# EAGLE design MOTOR DRIVER L298N (EAGLE 9.6.2)
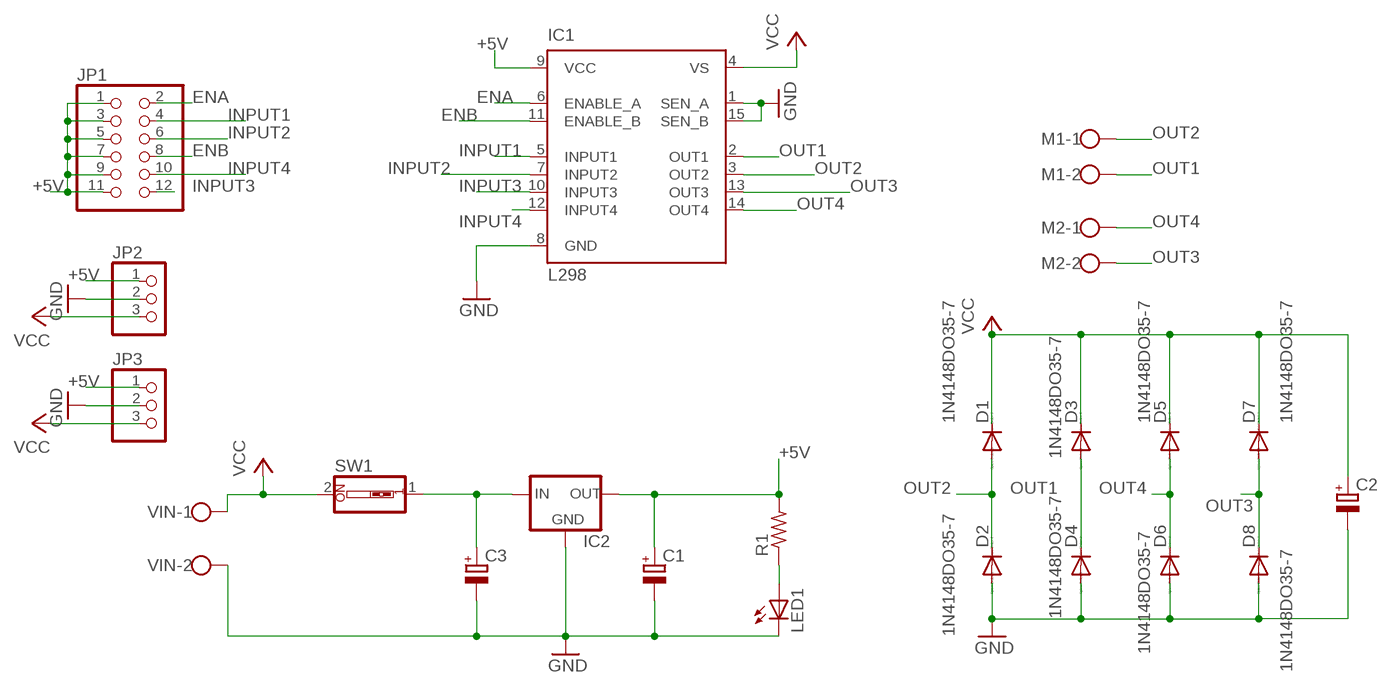
[diagram p0: schematic, sheet 1]

## Parts
C1  CPOL-EUE5-6  [E5-6]
C2  CPOL-EUE5-6  [E5-6]
C3  CPOL-EUE5-6  [E5-6]
D1  1N4148DO35-7  [DO35-7]
D2  1N4148DO35-7  [DO35-7]
D3  1N4148DO35-7  [DO35-7]
D4  1N4148DO35-7  [DO35-7]
D5  1N4148DO35-7  [DO35-7]
D6  1N4148DO35-7  [DO35-7]
D7  1N4148DO35-7  [DO35-7]
D8  1N4148DO35-7  [DO35-7]
IC1  L298  [MULTIWATT-15]
IC2  78MXXS  [78MXXS]
JP1  PINHD-2X6  [2X06]
JP2  PINHD-1X3  [1X03]
JP3  PINHD-1X3  [1X03]
LED1  LED5MM  [LED5MM]
M1  W237-102  [W237-102]
M2  W237-102  [W237-102]
R1  R-US_0204/7  [0204/7]
SW1  SW_DIP-1  [EDG-01]
VIN  W237-102  [W237-102]

## Nets
+5V: C1.+ IC1.9(VCC) IC2.OUT JP1.1 JP1.3 JP1.5 JP1.7 JP1.9 JP1.11 JP2.1 JP3.1 R1.2
ENA: IC1.6(ENABLE_A) JP1.2
ENB: IC1.11(ENABLE_B) JP1.8
GND: C1.- C2.- C3.- D2.A D4.A D6.A D8.A IC1.1(SEN_A) IC1.8(GND) IC1.15(SEN_B) IC2.GND JP2.2 JP3.2 LED1.K(C) VIN.2
INPUT1: IC1.5(INPUT1) JP1.4
INPUT2: IC1.7(INPUT2) JP1.6
INPUT3: IC1.10(INPUT3) JP1.12
INPUT4: IC1.12(INPUT4) JP1.10
N$2: LED1.A R1.1
N$3: C3.+ IC2.IN SW1.1
OUT1: D3.A D4.C IC1.2(OUT1) M1.2
OUT2: D1.A D2.C IC1.3(OUT2) M1.1
OUT3: D7.A D8.C IC1.13(OUT3) M2.2
OUT4: D5.A D6.C IC1.14(OUT4) M2.1
VCC: C2.+ D1.C D3.C D5.C D7.C IC1.4(VS) JP2.3 JP3.3 SW1.2 VIN.1

## Library data of the parts
C1-C3 = rcl:CPOL-EU: POLARIZED CAPACITOR, European symbol; SPICEPREFIX: C
D1-D8 = diode:1N4148: DIODE high speed (Philips)
IC1 = st-microelectronics:L298: DUAL FULL-BRIDGE DRIVER; MPN: L298N; OC_FARNELL: 1589425; OC_NEWARK: 32M1527
IC2 = v-reg:78MXXS: VOLTAGE REGULATOR
JP1 = pinhead:PINHD-2X6: PIN HEADER
JP2 JP3 = pinhead:PINHD-1X3: PIN HEADER
LED1 = led:LED: LED OSRAM: - CHIPLED LG R971, LG N971, LY N971, LG Q971, LY Q971, LO R971, LY R971 LH N974, LH R974 LS Q976, LO Q976, LY Q976 LO Q996 - Hyper CHIPLED LW Q18S LB Q993, LB Q99A, LB R99A - SideLED LS A670, LO A670, LY A670, LG A670, LP A670 LB A673, LV A673, LT A673, LW A673 LH A674 LY A675 LS A676, LA A676, LO A676, LY A676, LW A676 LS A679, LY A679, LG A679 - Hyper Micro SIDELED® LS Y876, LA Y876, LO Y876, LY Y876 LT Y87S - SmartLED LW L88C, LW L88S LB L89C, LB L89S, LG L890 LS L89K, LO L89K, LY L89K LS L896, LA L896, LO L896, LY L896 - TOPLED LS T670, LO T670, LY T670, LG T670, LP T670 LSG T670, LSP T670, LSY T670, LOP T670, LYG T670 LG T671, LOG T671, LSG T671 LB T673, LV T673, LT T673, LW T673 LH T674 LS T676, LA T676, LO T676, LY T676, LB T676, LH T676, LSB T676, LW T676 LB T67C, LV T67C, LT T67C, LS T67K, LO T67K, LY T67K, LW E67C LS E67B, LA E67B, LO E67B, LY E67B, LB E67C, LV E67C, LT E67C LW T67C LS T679, LY T679, LG T679 LS T770, LO T770, LY T770, LG T770, LP T770 LB T773, LV T773, LT T773, LW T773 LH T774 LS E675, LA E675, LY E675, LS T675 LS T776, LA T776, LO T776, LY T776, LB T776 LHGB T686 LT T68C, LB T68C - Hyper Mini TOPLED® LB M676 - Mini TOPLED Santana® LG M470 LS M47K, LO M47K, LY M47K Source: http://www.osram.convergy.de LUXEON: - LUMILED® LXK2-PW12-R00, LXK2-PW12-S00, LXK2-PW14-U00, LXK2-PW14-V00 LXK2-PM12-R00, LXK2-PM12-S00, LXK2-PM14-U00 LXK2-PE12-Q00, LXK2-PE12-R00, LXK2-PE12-S00, LXK2-PE14-T00, LXK2-PE14-U00 LXK2-PB12-K00, LXK2-PB12-L00, LXK2-PB12-M00, LXK2-PB14-N00, LXK2-PB14-P00, LXK2-PB14-Q00 LXK2-PR12-L00, LXK2-PR12-M00, LXK2-PR14-Q00, LXK2-PR14-R00 LXK2-PD12-Q00, LXK2-PD12-R00, LXK2-PD12-S00 LXK2-PH12-R00, LXK2-PH12-S00 LXK2-PL12-P00, LXK2-PL12-Q00, LXK2-PL12-R00 Source: www.luxeon.com KINGBRIGHT: KA-3528ASYC Source: www.kingbright.com
M1 M2 VIN = con-wago-500:W237-102: WAGO SCREW CLAMP; MPN: 237-102; OC_FARNELL: unknown; OC_NEWARK: 70K9898
R1 = rcl:R-US_: RESISTOR, American symbol; SPICEPREFIX: R
SW1 = special:SW_DIP-1: DIP SWITCH

## Board
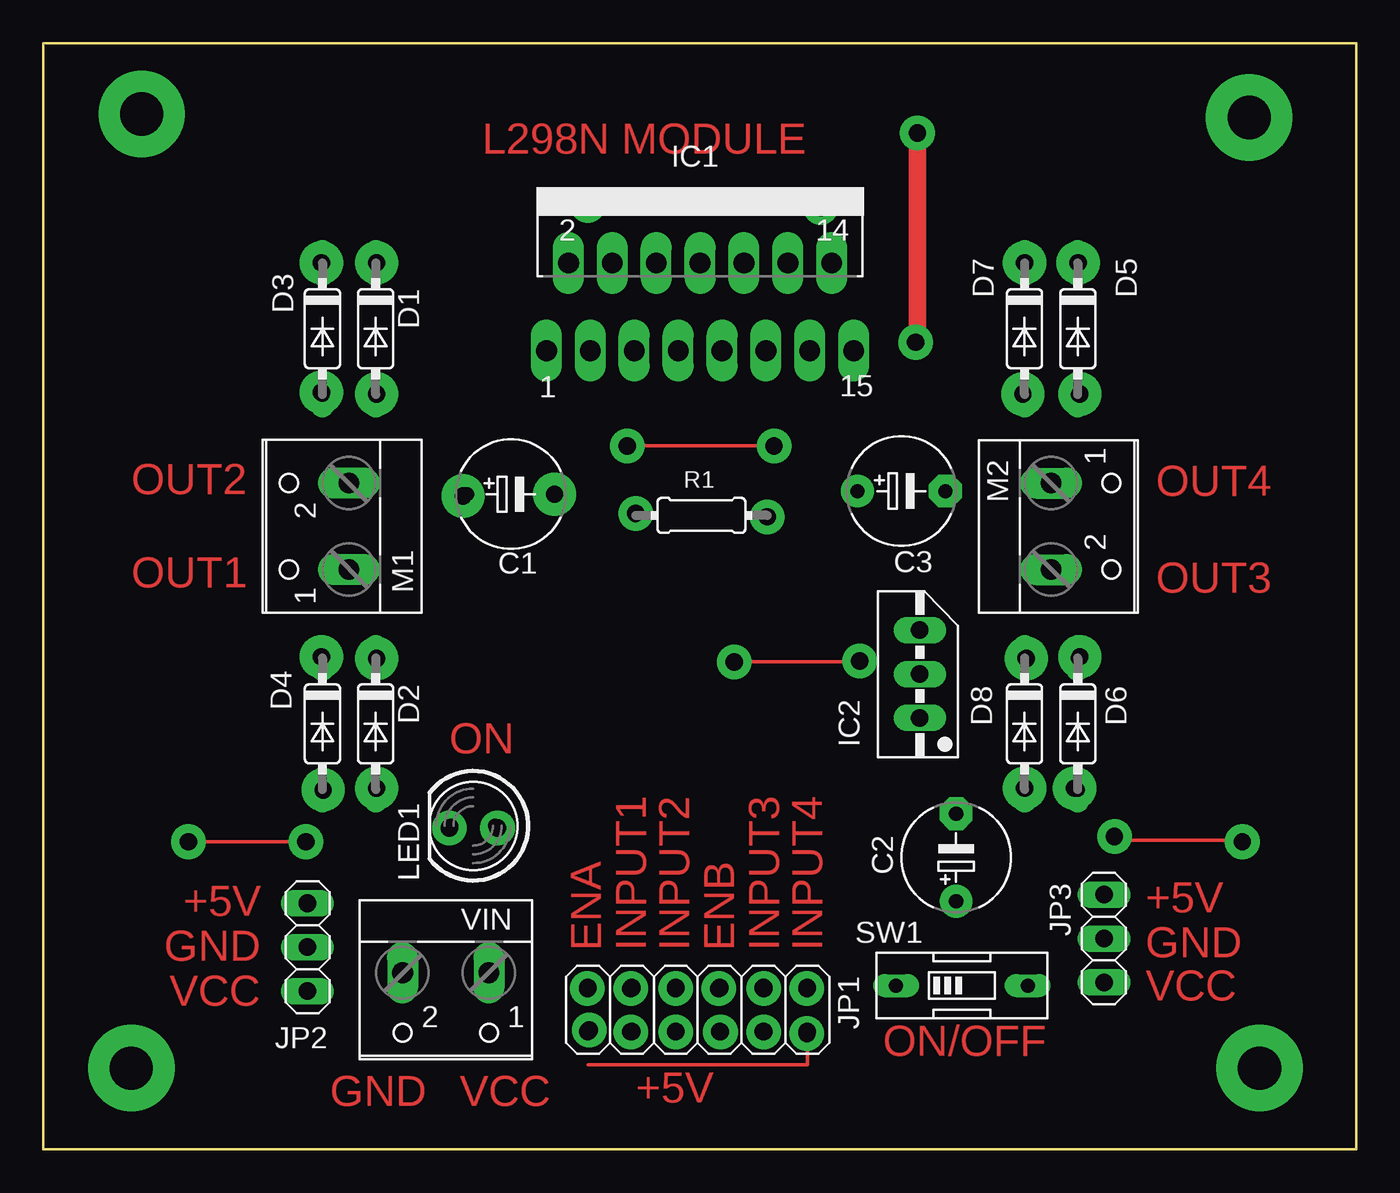
[diagram p1: board, top side]
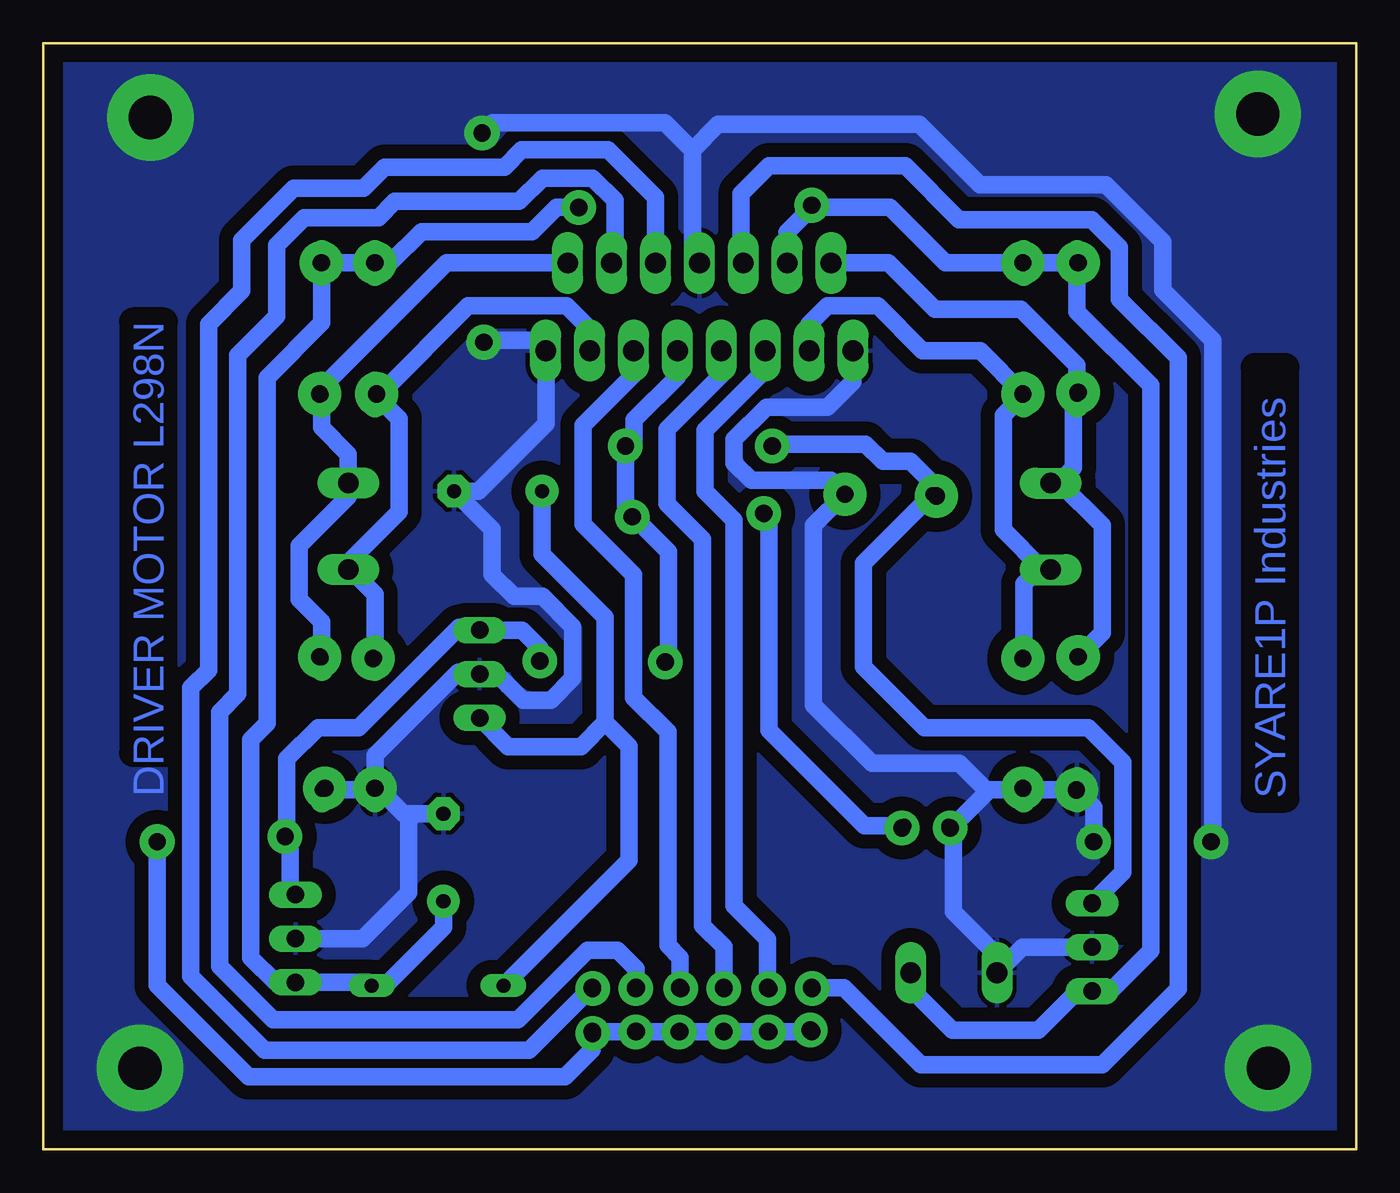
[diagram p2: board, bottom side, seen from below]

Size 76 x 64 mm. Coordinates in mm from the lower left corner, seen from the top.
Outline: 0,64 76,64 76,0 0,0 0,64
Copper layers (1*16): Top 0.035mm / dielectric 1.5mm / Bottom 0.035mm
Design rules "default": minimum track width 6mil, minimum drill 0.35mm, track to track 6mil, track to pad 6mil, pad to pad 6mil, via to via 6mil, smd to smd 6mil, copper to edge 40mil, drill to drill 6mil, minimum pad ring 10mil, minimum via ring 8mil, stop-mask expansion 4mil, vias tented up to drill 0mil, thermal gap 10mil

### Footprints (pad centres in the part's own frame; a part is rotated, then mirrored left to right if it is on the bottom)
E5-6 = drill 0.813 pad 1.905: + -2.54,0 | drill 0.813 pad 1.905 octagon: - 2.54,0
DO35-7 = drill 0.813 long: A 3.81,0; C -3.81,0
MULTIWATT-15 = drill 1.2 long: 1 -8.89,-7.62; 2 -7.62,-2.54; 3 -6.35,-7.62; 4 -5.08,-2.54; 5 -3.81,-7.62; 6 -2.54,-2.54; 7 -1.27,-7.62; 8 0,-2.54; 9 1.27,-7.62; 10 2.54,-2.54; 11 3.81,-7.62; 12 5.08,-2.54; 13 6.35,-7.62; 14 7.62,-2.54; 15 8.89,-7.62
78MXXS = drill 1.016 long: GND 0,-2.54; IN -2.54,-2.54; OUT 2.54,-2.54
2X06 = drill 1.016 octagon: 1 -6.35,-1.27; 2 -6.35,1.27; 3 -3.81,-1.27; 4 -3.81,1.27; 5 -1.27,-1.27; 6 -1.27,1.27; 7 1.27,-1.27; 8 1.27,1.27; 9 3.81,-1.27; 10 3.81,1.27; 11 6.35,-1.27; 12 6.35,1.27
1X03 = drill 1.016 long: 1 -2.54,0; 2 0,0; 3 2.54,0
LED5MM = drill 0.813 octagon: A -1.27,0; K 1.27,0
W237-102 = drill 1.194 long: 1 -2.5,-1.27; 2 2.5,-1.27
0204/7 = drill 0.813 octagon: 1 -3.81,0; 2 3.81,0
EDG-01 = drill 0.813 long: 1 0,-3.81; 2 0,3.81

### Placement (x,y rotation side)
C1  27.07,37.91 0 top
C2  52.84,16.89 90 top
C3  49.67,38.09 0 top
D1  19.24,47.48 270 top
D2  19.24,24.62 270 top
D3  16.16,47.48 270 top
D4  16.16,24.62 270 top
D5  59.88,47.48 270 top
D6  59.88,24.62 270 top
D7  56.8,47.48 270 top
D8  56.8,24.62 270 top
IC1  38.02,53.83 0 top
IC2  48.2,27.5 90 top
JP1  37.88,8.08 0 top
JP2  15.3,11.7 270 top
JP3  61.4,12.2 270 top
LED1  24.89,18.72 180 top
M1  16.43,36.05 90 top
M2  59.61,36.05 270 top
R1  38.1,36.68 0 top
SW1  53.17,9.48 270 top
VIN  23.3,8.95 180 top

### Tracks (layer width: path | path; a pad name or v marks a point on that pad's centre or on a via)
+5V  (via drill 1 pad 2)
  Top 0.2: JP1.11 44.23,4.9 31.53,4.9 | v42.3,40.7 v33.8,40.7 | v40,28.2 47.2,28.2 v47.25,28.25 | 69.3,17.9 62.2,17.9
  Top 1.016: v40,28.2 40.05,28.25 | v62,18.1 62.2,17.9 | 69.3,17.9 v69.4,17.8
  Bottom 1.016: IC1.9 39.29,44.71 41.8,42.2 41.8,40.7 v42.3,40.7 | 42.3,40.2 v42.3,40.7 | C1.+ 24.61,37.91 | C1.+ 28.53,33.91 28.53,27.93 25,24.4 15.5,24.4 13.5,22.4 13.5,16.04 JP2.1 | JP3.1 61.7,15.04 61.7,17.8 v62,18.1 61.9,18.2 61.9,22.6 60.1,24.4 57.75,24.4 51.93,30.22 50.92,30.22 | v40,28.2 39.8,28.4 39.8,34.57 R1.2 42.3,37.07 v42.3,40.7 | v69.4,17.8 69.4,9.5 64.1,4.2 45.8,4.2 44.23,5.77 JP1.11 JP1.9 JP1.7 JP1.5 JP1.3 JP1.1 | v47.25,28.25 47.25,29 48.29,30.04 IC2.OUT 50.92,30.22 | 50.92,30.22 50.09,30.22 | v33.8,40.7 33.7,40.8 28.4,40.8 27.4,39.8 25.8,39.8 24.53,38.53 C1.+
ENA
  Bottom 1.016: IC1.6 35.6,51.41 35.6,55.3 34,56.9 26.1,56.9 23,53.8 15.3,53.8 13.7,52.2 13.7,49.2 10.3,45.8 10.3,9.3 14.7,4.9 25.2,4.9 29.65,9.35 JP1.2
ENB
  Bottom 1.016: IC1.11 41.83,44.81 44.75,41.89 44.75,36.17 41.83,33.25 41.83,26.13 39.85,24.15 39.85,11.8 39.15,11.1 JP1.8
GND  (via drill 1 pad 2, 1 pad 2.5, 2.5 pad 5)
  Top 0.2: v8.4,17.8 v15.2,17.8
  Top 1.016: v50.5,46.7 50.6,46.8 v50.6,58.8
  Bottom 1.016: 29.13,45.33 IC1.1 29.13,44.42 30.6,42.95 34.15,42.95 36.01,41.09 36.01,39.71 35.01,38.71 30.41,38.71 C1.- 31.41,36.11 31.41,25.71 28.04,22.34 22.96,22.34 21.44,20.81 D2.A | LED1.K 23.33,18.72 | 23.33,18.72 21.24,20.81 D2.A | D8.A D6.A | D4.A v16.2,20.81 | v16.2,20.81 D2.A | 23.33,18.72 23.33,13.75 20.8,11.22 VIN.2 19.32,11.7 JP2.2 | 38.32,51.59 IC1.8 38.42,51.69 38.42,57.82 | v8.4,17.8 8.3,17.8 8.3,46.8 11.2,49.7 11.2,52.5 14.5,55.8 21.8,55.8 25.3,59.3 36.94,59.3 38.42,57.82 | v15.2,17.8 15.2,19.8 v16.2,20.8 v16.2,20.81 | JP3.2 57.5,12.2 54.84,14.86 54.84,19.03 54.44,19.43 C2.- 55.14,19.43 56.52,20.81 D8.A | v50.5,46.7 50.4,46.8 47.5,46.8 IC1.15 46.91,41.99 50.81,38.09 C3.- 50.01,35.89 50.01,33.26 48.75,32 47.1,32 45.35,30.25 45.35,27.25 46.6,26 48.24,26 49.74,27.5 IC2.GND 50.84,27.6 52,27.6 56.8,22.8 v56.8,20.9 D8.A | v50.6,58.8 50,59.4 40,59.4 38.42,57.82
  other vias: 5.7,59.9 69.8,59.7 70.4,4.7 5.1,4.7
  pour Bottom (isolate 0.813): 0.4,63.8 75.2,63.8 75.2,0.5 0.4,0.5
INPUT1
  Bottom 1.016: IC1.5 34.21,45.11 37.7,41.62 37.7,38.09 36.01,36.4 36.01,14.09 34.07,12.15 JP1.4
INPUT2
  Bottom 1.016: IC1.7 36.75,44.81 39.9,41.66 39.9,37.35 37.85,35.3 37.85,12.95 36.61,11.71 JP1.6
INPUT3
  Bottom 1.016: 40.44,51.41 IC1.10 40.56,55.09 43.3,57.83 48.3,57.83 49.3,56.83 56.23,56.83 57.47,55.6 61.5,55.6 64.5,52.6 64.5,49.67 66.43,47.73 66.43,27.73 67.47,26.7 67.47,10.02 63.18,5.73 47.87,5.73 44.25,9.35 JP1.12
INPUT4
  Bottom 1.016: JP1.10 41.69,10.45 42.75,11.51 44.5,11.51 48.51,7.5 62.7,7.5 65.8,10.6 65.8,25.3 64.75,26.35 64.75,45.95 62.5,48.2 62.5,52.3 60.9,53.9 56.6,53.9 55.65,54.85 48.45,54.85 47.1,56.2 44.2,56.2 42.9,54.9 42.9,51.49 IC1.12
N$2
  Bottom 1.016: R1.1 33.99,36.38 33.99,24.25 28.46,18.72 LED1.A
N$3
  Bottom 1.016: C3.+ 47.13,34.44 43.48,30.79 43.48,24.7 | SW1.1 42.1,16.74 42.1,23.32 43.48,24.7 | IC2.IN 49.08,23.3 44.88,23.3 43.48,24.7
N$7  (via drill 1 pad 2)
  other vias: 41.9,36.6
N$8  (via drill 1 pad 2)
  other vias: 23.5,18.6
N$9  (via drill 1 pad 2)
  other vias: 26.3,18.6
N$10  (via drill 1 pad 2)
  other vias: 31.6,6.9
N$11  (via drill 1 pad 2)
  other vias: 34,6.8
N$12  (via drill 1 pad 2)
  other vias: 36.6,6.8
N$13  (via drill 1 pad 2)
  other vias: 39.2,6.8
N$14  (via drill 1 pad 2)
  other vias: 41.7,6.8
N$15  (via drill 1 pad 2)
  other vias: 44.2,6.7
N$16  (via drill 1 pad 2)
  other vias: 44.2,9.3
N$17  (via drill 1 pad 2)
  other vias: 41.7,9.3
N$18  (via drill 1 pad 2)
  other vias: 39.1,9.3
N$19  (via drill 1 pad 2)
  other vias: 36.6,9.3
N$20  (via drill 1 pad 2)
  other vias: 34,9.3
N$21  (via drill 1 pad 2)
  other vias: 31.5,9.3
N$22  (via drill 1 pad 2)
  other vias: 34.3,36.8
N$23  (via drill 1 pad 2.5)
  other vias: 16.1,28.5
N$24  (via drill 1 pad 2.5)
  other vias: 19.3,28.4
N$25  (via drill 1 pad 2.5)
  other vias: 24.3,37.8
N$26  (via drill 1 pad 2.5)
  other vias: 19.3,20.9
N$27  (via drill 1 pad 2.5)
  other vias: 16.1,43.8
N$28  (via drill 1 pad 2.5)
  other vias: 19.3,43.7
N$29  (via drill 1 pad 2.5)
  other vias: 16.1,51.3
N$30  (via drill 1 pad 2.5)
  other vias: 19.3,51.3
N$31  (via drill 1 pad 2.5)
  other vias: 59.7,20.9
N$32  (via drill 1 pad 2.5)
  other vias: 56.9,28.4
N$33  (via drill 1 pad 2.5)
  other vias: 60,28.5
N$34  (via drill 1 pad 2.5)
  other vias: 56.7,43.7
N$35  (via drill 1 pad 2.5)
  other vias: 60,43.7
N$36  (via drill 1 pad 2.5)
  other vias: 56.8,51.3
N$37  (via drill 1 pad 2.5)
  other vias: 59.9,51.3
N$38  (via drill 1 pad 2.5)
  other vias: 29.6,37.9
OUT1
  Bottom 1.016: IC1.2 27.09,51.29 24.4,48.6 19.4,48.6 16.16,45.36 D3.A 16.37,43.67 16.37,39.43 17.25,38.55 M1.2 17.15,38.55 14.7,36.1 14.7,29.89 D4.C
OUT2
  Bottom 1.016: IC1.3 31.67,47.73 30.6,48.8 27.7,48.8 25.1,46.2 21.77,46.2 D1.A 20.44,42.47 20.44,35.84 18.15,33.55 M1.1 18.42,33.55 19.24,32.73 D2.C
OUT3
  Bottom 1.016: IC1.13 44.37,47.47 45.7,48.8 51.4,48.8 56.33,43.87 56.8,43.87 D7.A 55.4,42.27 55.4,36.89 58.34,33.95 M2.2 58.22,33.55 56.8,32.13 D8.C
OUT4
  Bottom 1.016: IC1.14 52.66,51.29 59.88,44.07 D5.A 59.88,41.77 58.34,40.23 M2.1 58.34,37.76 61.18,34.92 61.18,31.83 59.88,30.53 D6.C
VCC  (via drill 1 pad 2)
  Top 0.2: v31.53,54.63 44.87,54.63
  Top 1.016: v45,54.5 44.87,54.63
  Bottom 1.016: IC1.4 32.94,53.06 31.53,54.47 v31.53,54.63 31.4,54.5 27,54.5 23.79,51.29 D1.C D3.C 16.16,48.46 11.9,44.2 11.9,11.5 14.24,9.16 JP2.3 16.14,9.16 18.4,6.9 23.38,6.9 25.8,9.32 VIN.1 | v45,54.5 46.3,54.5 47.7,53.1 54.1,53.1 55.91,51.29 D7.C D5.C 59.88,47.82 63.05,44.65 63.05,24.65 64,23.7 64,11.1 62.56,9.66 JP3.3 57.16,9.66 SW1.2 56.22,9.48 52.84,12.86 C2.+

### Text on the board
Top: L298N MODULE | OUT2 | OUT4 | OUT1 | OUT3 | ON | +5V | +5V | GND | ENA | INPUT1 | INPUT2 | ENB | INPUT3 | INPUT4 | GND | VCC | VCC | ON/OFF | GND | VCC | +5V
Bottom: DRIVER MOTOR L298N | SYARE1P Industries